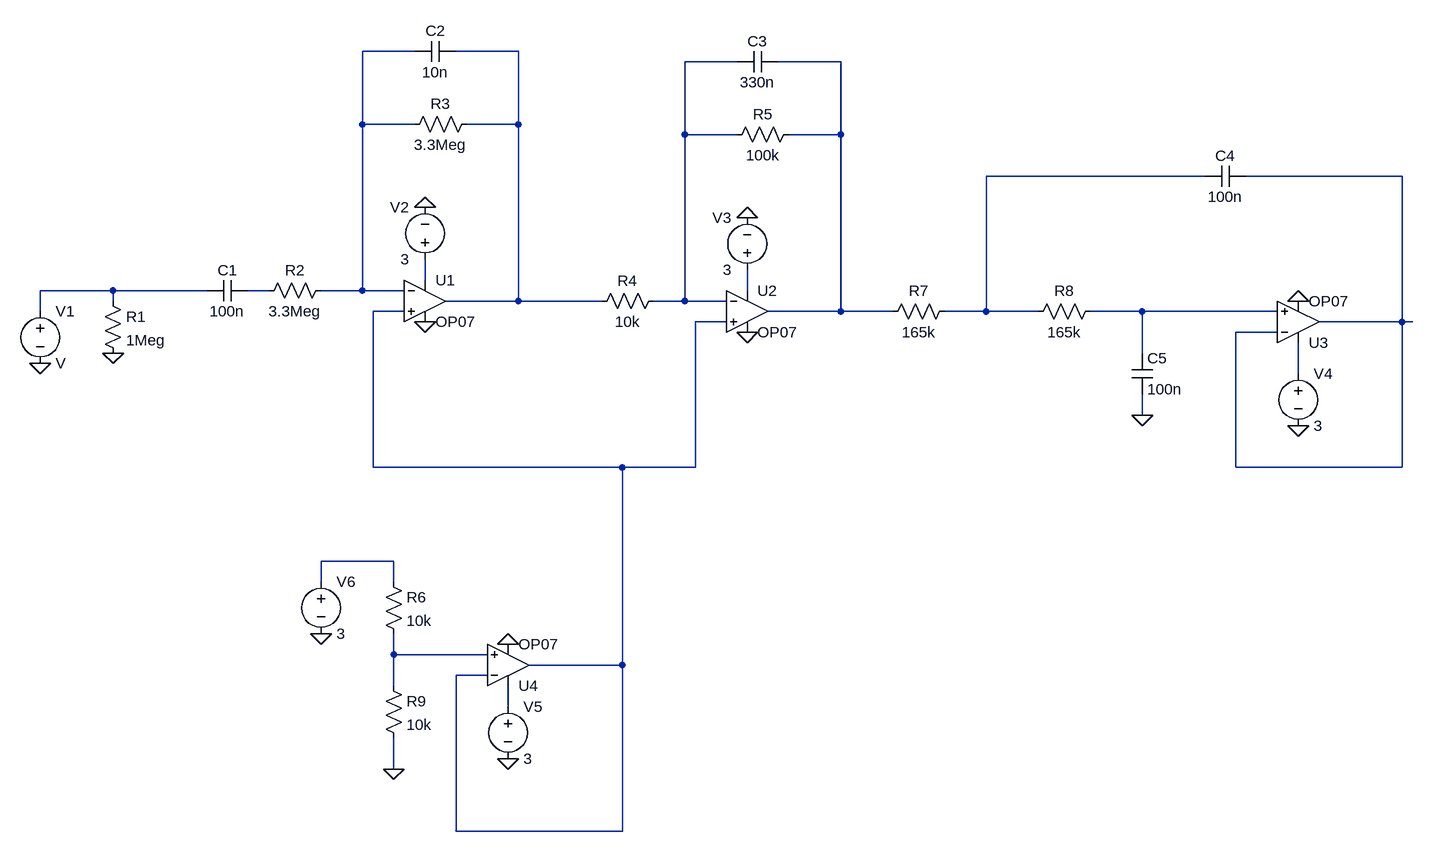
[diagram p0: schematic GSR.asc]
GSR.asc, the LTspice schematic file:
Version 4
SHEET 1 3416 900
WIRE 704 -304 624 -304
WIRE 864 -304 768 -304
WIRE 1200 -288 1120 -288
WIRE 1360 -288 1264 -288
WIRE 624 -192 624 -304
WIRE 704 -192 624 -192
WIRE 864 -192 864 -304
WIRE 864 -192 784 -192
WIRE 1120 -176 1120 -288
WIRE 1200 -176 1120 -176
WIRE 1360 -176 1360 -288
WIRE 1360 -176 1280 -176
WIRE 1920 -112 1584 -112
WIRE 2224 -112 1984 -112
WIRE 720 48 720 16
WIRE 240 64 128 64
WIRE 384 64 240 64
WIRE 480 64 448 64
WIRE 624 64 624 -192
WIRE 624 64 560 64
WIRE 688 64 624 64
WIRE 1216 64 1216 32
WIRE 240 80 240 64
WIRE 864 80 864 -192
WIRE 864 80 752 80
WIRE 992 80 864 80
WIRE 1120 80 1120 -176
WIRE 1120 80 1072 80
WIRE 1184 80 1120 80
WIRE 128 96 128 64
WIRE 688 96 640 96
WIRE 1360 96 1360 -176
WIRE 1360 96 1248 96
WIRE 1440 96 1360 96
WIRE 1584 96 1584 -112
WIRE 1584 96 1520 96
WIRE 1664 96 1584 96
WIRE 1824 96 1744 96
WIRE 2032 96 1824 96
WIRE 1184 112 1136 112
WIRE 2224 112 2224 -112
WIRE 2224 112 2096 112
WIRE 2240 112 2224 112
WIRE 2032 128 1968 128
WIRE 1824 160 1824 96
WIRE 2064 192 2064 144
WIRE 1824 256 1824 224
WIRE 640 336 640 96
WIRE 1024 336 640 336
WIRE 1136 336 1136 112
WIRE 1136 336 1024 336
WIRE 1968 336 1968 128
WIRE 2224 336 2224 112
WIRE 2224 336 1968 336
WIRE 672 480 560 480
WIRE 560 512 560 480
WIRE 672 512 672 480
WIRE 672 624 672 592
WIRE 816 624 672 624
WIRE 1024 640 1024 336
WIRE 1024 640 880 640
WIRE 816 656 768 656
WIRE 672 672 672 624
WIRE 848 704 848 672
WIRE 672 800 672 752
WIRE 768 896 768 656
WIRE 1024 896 1024 640
WIRE 1024 896 768 896
FLAG 128 176 0
FLAG 240 160 0
FLAG 720 -64 0
FLAG 720 112 0
FLAG 1216 -48 0
FLAG 1216 128 0
FLAG 2064 80 0
FLAG 2064 272 0
FLAG 1824 256 0
FLAG 848 784 0
FLAG 848 608 0
FLAG 672 800 0
FLAG 560 592 0
SYMBOL voltage 128 80 R0
SYMATTR InstName V1
SYMBOL res 224 64 R0
SYMATTR InstName R1
SYMATTR Value 1Meg
SYMBOL cap 448 48 R90
WINDOW 0 0 32 VBottom 2
WINDOW 3 32 32 VTop 2
SYMATTR InstName C1
SYMATTR Value 100n
SYMBOL res 576 48 R90
WINDOW 0 0 56 VBottom 2
WINDOW 3 32 56 VTop 2
SYMATTR InstName R2
SYMATTR Value 3.3Meg
SYMBOL Opamps\\OP07 720 16 R0
SYMATTR InstName U1
SYMBOL res 800 -208 R90
WINDOW 0 0 56 VBottom 2
WINDOW 3 32 56 VTop 2
SYMATTR InstName R3
SYMATTR Value 3.3Meg
SYMBOL cap 768 -320 R90
WINDOW 0 0 32 VBottom 2
WINDOW 3 32 32 VTop 2
SYMATTR InstName C2
SYMATTR Value 10n
SYMBOL voltage 720 32 R180
WINDOW 0 24 96 Left 2
WINDOW 3 24 16 Left 2
WINDOW 123 0 0 Left 0
WINDOW 39 0 0 Left 0
SYMATTR InstName V2
SYMATTR Value 3
SYMBOL res 1088 64 R90
WINDOW 0 0 56 VBottom 2
WINDOW 3 32 56 VTop 2
SYMATTR InstName R4
SYMATTR Value 10k
SYMBOL Opamps\\OP07 1216 32 R0
SYMATTR InstName U2
SYMBOL res 1296 -192 R90
WINDOW 0 0 56 VBottom 2
WINDOW 3 32 56 VTop 2
SYMATTR InstName R5
SYMATTR Value 100k
SYMBOL cap 1264 -304 R90
WINDOW 0 0 32 VBottom 2
WINDOW 3 32 32 VTop 2
SYMATTR InstName C3
SYMATTR Value 330n
SYMBOL voltage 1216 48 R180
WINDOW 0 24 96 Left 2
WINDOW 3 24 16 Left 2
WINDOW 123 0 0 Left 0
WINDOW 39 0 0 Left 0
SYMATTR InstName V3
SYMATTR Value 3
SYMBOL res 1536 80 R90
WINDOW 0 0 56 VBottom 2
WINDOW 3 32 56 VTop 2
SYMATTR InstName R7
SYMATTR Value 165k
SYMBOL res 1760 80 R90
WINDOW 0 0 56 VBottom 2
WINDOW 3 32 56 VTop 2
SYMATTR InstName R8
SYMATTR Value 165k
SYMBOL cap 1984 -128 R90
WINDOW 0 0 32 VBottom 2
WINDOW 3 32 32 VTop 2
SYMATTR InstName C4
SYMATTR Value 100n
SYMBOL Opamps\\OP07 2064 176 M180
SYMATTR InstName U3
SYMBOL voltage 2064 176 R0
WINDOW 123 0 0 Left 0
WINDOW 39 0 0 Left 0
SYMATTR InstName V4
SYMATTR Value 3
SYMBOL cap 1808 160 R0
SYMATTR InstName C5
SYMATTR Value 100n
SYMBOL Opamps\\OP07 848 704 M180
SYMATTR InstName U4
SYMBOL voltage 848 688 R0
WINDOW 123 0 0 Left 0
WINDOW 39 0 0 Left 0
SYMATTR InstName V5
SYMATTR Value 3
SYMBOL res 656 496 R0
SYMATTR InstName R6
SYMATTR Value 10k
SYMBOL res 656 656 R0
SYMATTR InstName R9
SYMATTR Value 10k
SYMBOL voltage 560 496 R0
WINDOW 123 0 0 Left 0
WINDOW 39 0 0 Left 0
SYMATTR InstName V6
SYMATTR Value 3

The netlist it stands for:
* GSR.asc
V1 N008 0 V
R1 N008 0 1Meg
C1 N009 N008 100n
R2 N001 N009 3.3Meg
XU1 N011 N001 N007 0 N002 LT1001  ; OP07, pins In+ In- V+ V- OUT
R3 N002 N001 3.3Meg
C2 N002 N001 10n
V2 N007 0 3
R4 N003 N002 10k
XU2 N011 N003 N010 0 N004 LT1001  ; OP07, pins In+ In- V+ V- OUT
R5 N004 N003 100k
C3 N004 N003 330n
V3 N010 0 3
R7 N005 N004 165k
R8 N012 N005 165k
C4 N006 N005 100n
XU3 N012 N006 N013 0 N006 LT1001  ; OP07, pins In+ In- V+ V- OUT
V4 N013 0 3
C5 N012 0 100n
XU4 N015 N011 N016 0 N011 LT1001  ; OP07, pins In+ In- V+ V- OUT
V5 N016 0 3
R6 N014 N015 10k
R9 N015 0 10k
V6 N014 0 3
.lib LTC.lib
.backanno
.end